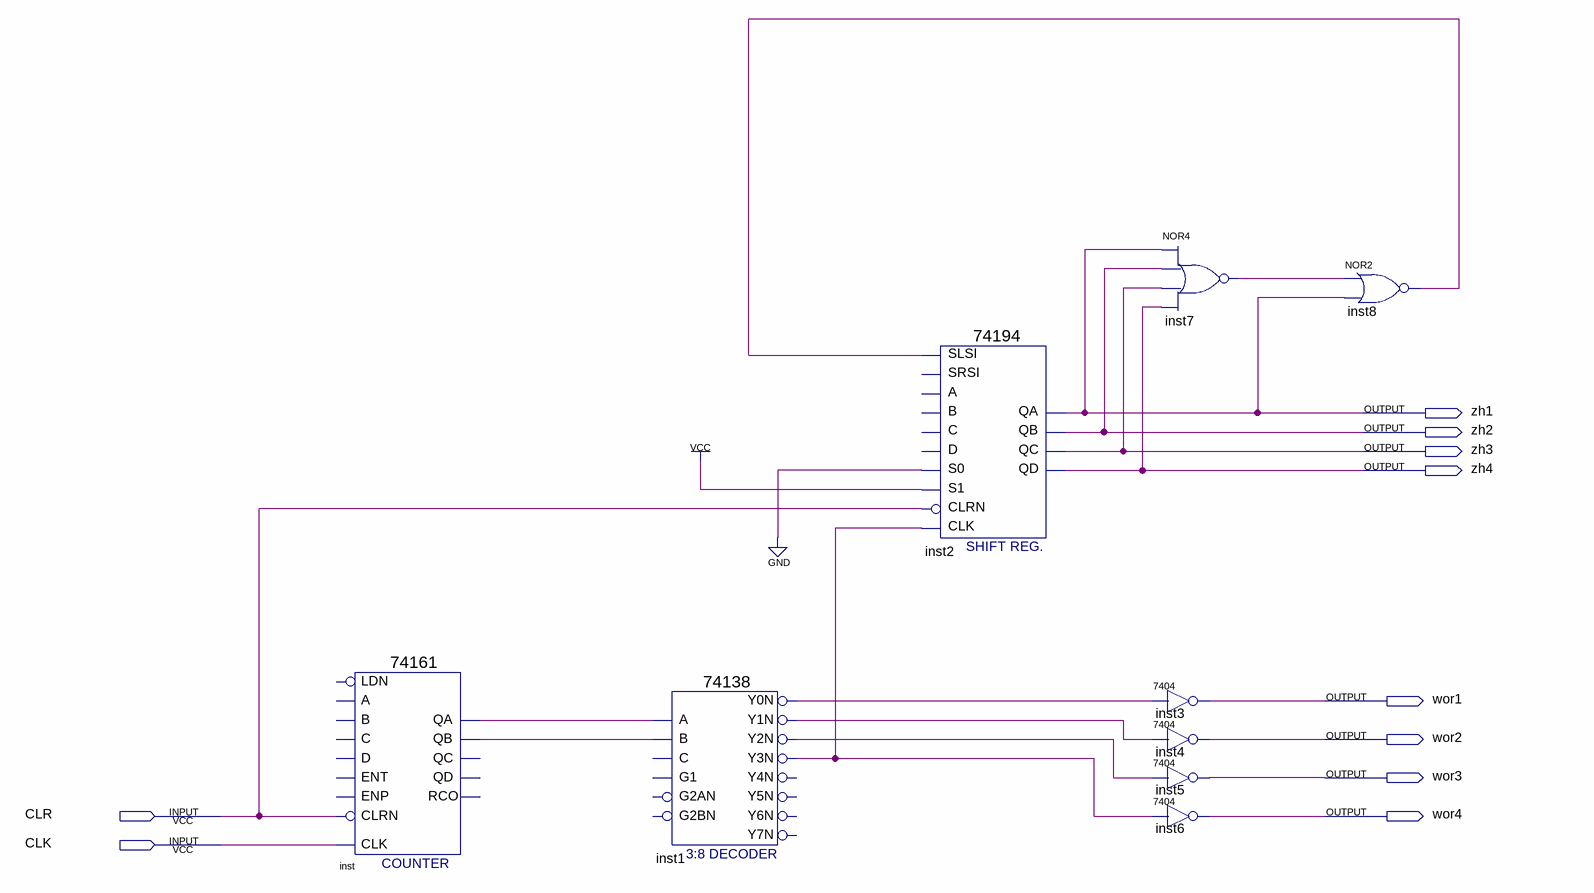
[diagram p0: schematic sheet]
// Quartus schematic exp12.bdf as structural Verilog: 9 symbols, 10 pins
module exp12 (
  input  CLR,
  input  CLK,
  output zh1,
  output zh2,
  output zh3,
  output zh4,
  output wor1,
  output wor2,
  output wor3,
  output wor4
);

  wire inst1_y0n, inst1_y1n, inst1_y2n, inst1_y3n, inst7_out, inst8_out, inst_qa, inst_qb;

  \74161  inst (.CLRN(CLR), .CLK(CLK), .QB(inst_qb), .QA(inst_qa));  // open: ENP, LDN, A, D, ENT, B, C, QD, QC, RCO
  \74138  inst1 (
    .A(inst_qa), .B(inst_qb), .Y0N(inst1_y0n), .Y1N(inst1_y1n), .Y2N(inst1_y2n), .Y3N(inst1_y3n));  // open: G1, C, G2AN, G2BN, Y4N, Y5N, Y6N, Y7N
  \74194  inst2 (
    .SLSI(inst8_out), .CLK(inst1_y3n), .CLRN(CLR), .S1(1'b1), .S0(1'b0), .QA(zh1), .QB(zh2), .QC(zh3),
    .QD(zh4));  // open: SRSI, B, C, D, A
  nor inst7 (inst7_out, zh1, zh2, zh3, zh4);
  \7404  inst3 (.\2 (inst1_y0n), .\1 (wor1));
  \7404  inst4 (.\2 (inst1_y1n), .\1 (wor2));
  \7404  inst5 (.\2 (inst1_y2n), .\1 (wor3));
  \7404  inst6 (.\2 (inst1_y3n), .\1 (wor4));
  nor inst8 (inst8_out, inst7_out, zh1);
endmodule
